# EAGLE design homecomputer-6502 (EAGLE 6.5.0)
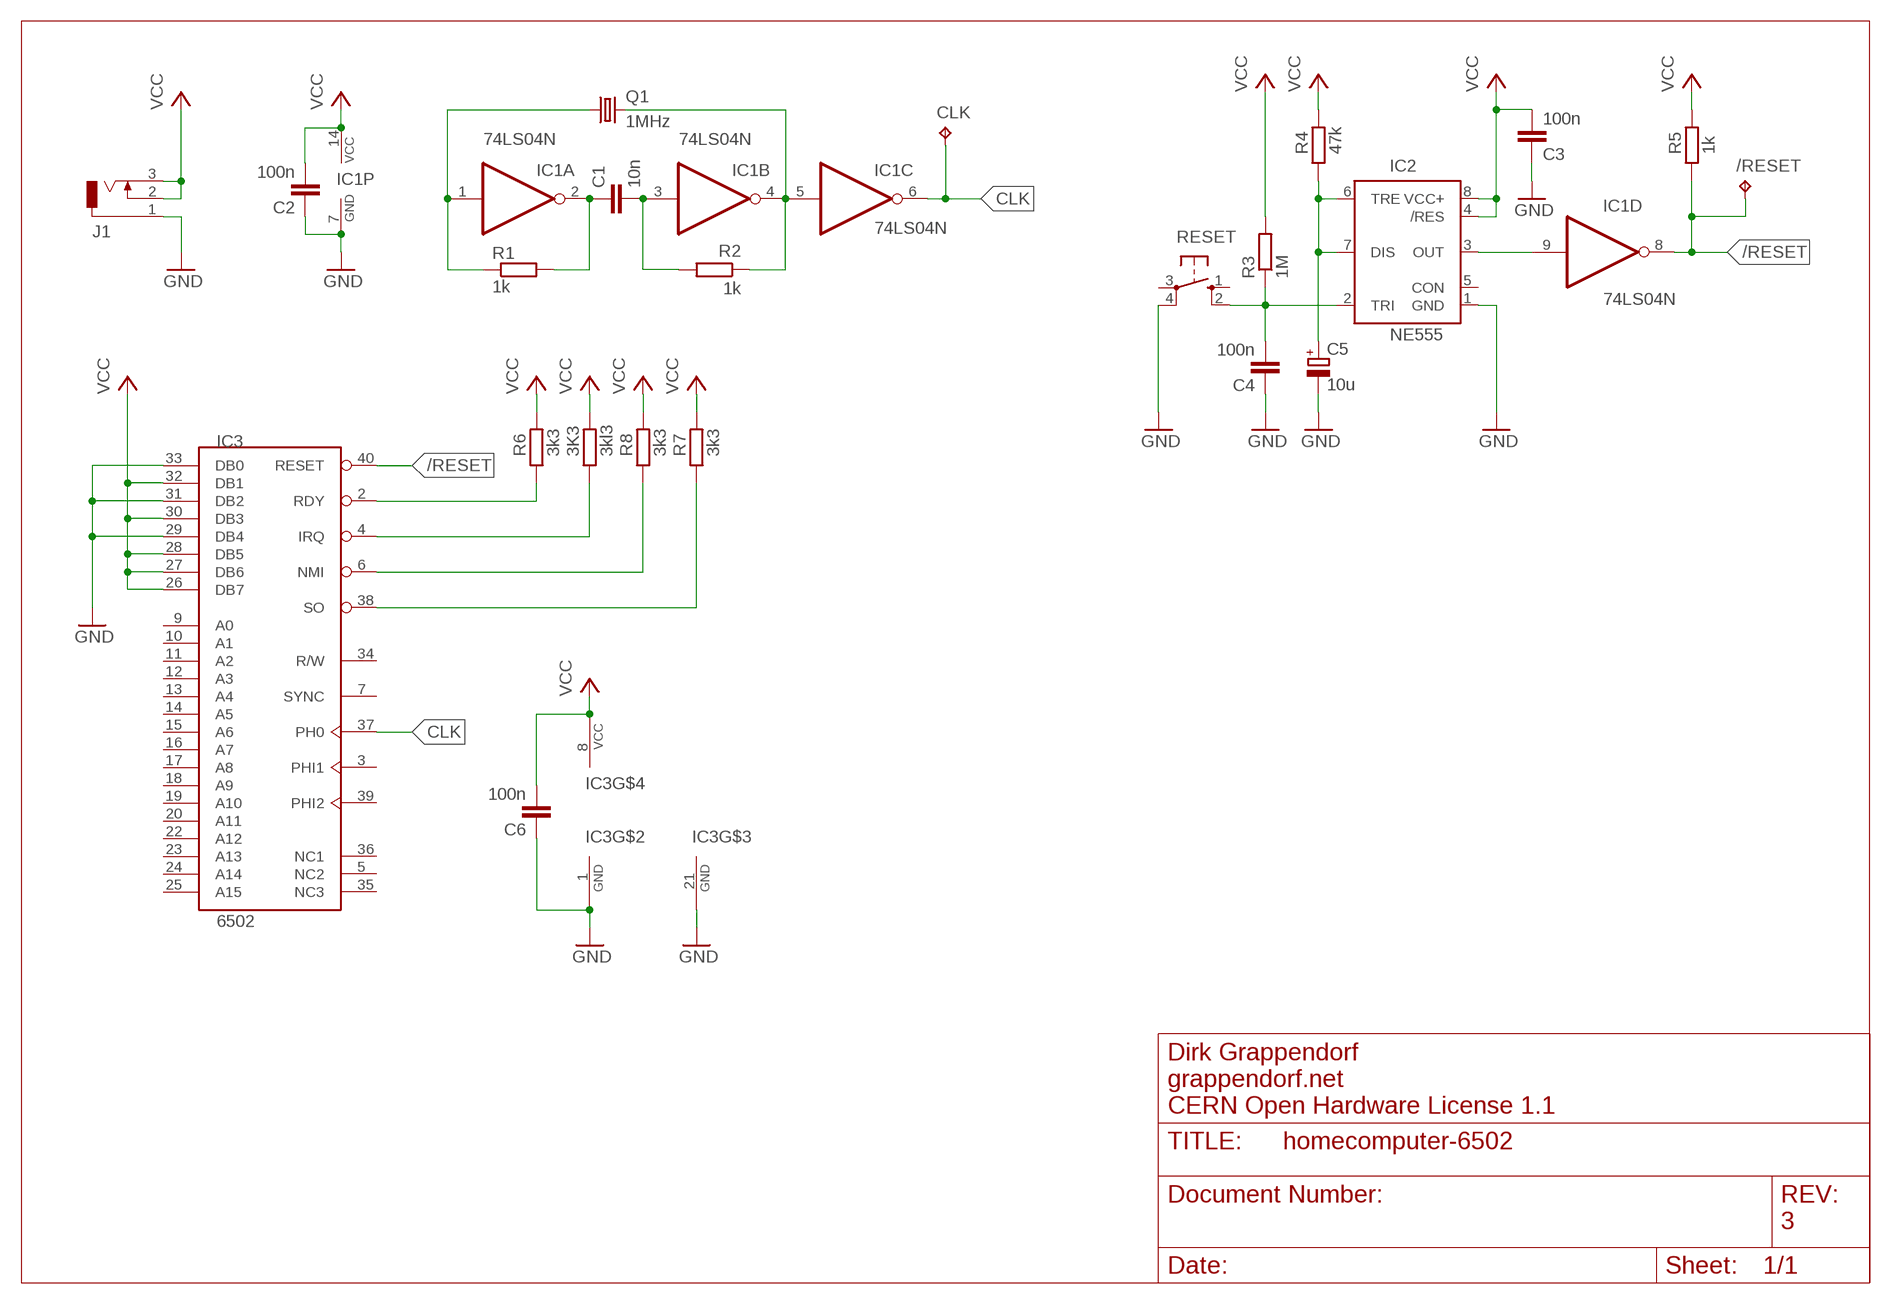
[diagram p0: schematic, sheet 1]

## Parts
3K3  3kl3  R-EU_0204/5  [0204/5]
/RESET  TPPAD1-13  [P1-13]
C1  10n  C-EU025-024X044  [C025-024X044]
C2  100n  C-EU025-024X044  [C025-024X044]
C3  100n  C-EU025-024X044  [C025-024X044]
C4  100n  C-EU025-024X044  [C025-024X044]
C5  10u  CPOL-EUE2,5-6E  [E2,5-6E]
C6  100n  C-EU025-024X044  [C025-024X044]
CLK  TPPAD1-13  [P1-13]
IC1  74LS04N  [DIL14]
IC2  NE555  [DIL-08]
IC3  6502  [DIP40]
J1  DCJ0303  [DCJ0303]
Q1  1MHz  CRYSTALHC49U-V  [HC49U-V]
R1  1k  R-EU_0204/5  [0204/5]
R2  1k  R-EU_0204/5  [0204/5]
R3  1M  R-EU_0204/5  [0204/5]
R4  47k  R-EU_0204/5  [0204/5]
R5  1k  R-EU_0204/5  [0204/5]
R6  3k3  R-EU_0204/5  [0204/5]
R7  3k3  R-EU_0204/5  [0204/5]
R8  3k3  R-EU_0204/5  [0204/5]
RESET  10-XX  [B3F-10XX]

## Nets
/RESET: /RESET.TP IC1.8(D:O) IC3.40(RESET) R5.1
CLK: CLK.TP IC1.6(C:O) IC3.37(PH0)
GND: C2.1 C3.1 C4.1 C5.- C6.1 IC1.7(P:GND) IC2.1(GND) IC3.1(GND) IC3.21(GND) IC3.29(DB4) IC3.31(DB2) IC3.33(DB0) J1.1 RESET.4(P1)
N$1: IC1.1(A:I) Q1.1 R1.1
N$2: C1.1 IC1.2(A:O) R1.2
N$3: IC3.2(RDY) R6.1
N$4: C5.+ IC2.6(TRE) IC2.7(DIS) R4.1
N$5: IC1.9(D:I) IC2.3(OUT)
N$6: C4.2 IC2.2(TRI) R3.1 RESET.2(S1)
N$7: C1.2 IC1.3(B:I) R2.2
N$8: IC1.4(B:O) IC1.5(C:I) Q1.2 R2.1
N$9: 3K3.1 IC3.4(IRQ)
N$10: IC3.6(NMI) R8.1
N$11: IC3.38(SO) R7.1
VCC: 3K3.2 C2.2 C3.2 C6.2 IC1.14(P:VCC) IC2.4(/RES) IC2.8(VCC+) IC3.8(VCC) IC3.26(DB7) IC3.27(DB6) IC3.28(DB5) IC3.30(DB3) IC3.32(DB1) J1.2 J1.3 R3.2 R4.2 R5.2 R6.2 R7.2 R8.2
Unconnected: IC1.10(E:O) IC1.11(E:I) IC1.12(F:O) IC1.13(F:I) IC2.5(CON) IC3.3(PHI1) IC3.5(NC2) IC3.7(SYNC) IC3.9(A0) IC3.10(A1) IC3.11(A2) IC3.12(A3) IC3.13(A4) IC3.14(A5) IC3.15(A6) IC3.16(A7) IC3.17(A8) IC3.18(A9) IC3.19(A10) IC3.20(A11) IC3.22(A12) IC3.23(A13) IC3.24(A14) IC3.25(A15) IC3.34(R/W) IC3.35(NC3) IC3.36(NC1) IC3.39(PHI2) RESET.1(S) RESET.3(P)

## Notes on the sheet
- Dirk Grappendorf
- grappendorf.net
- CERN Open Hardware License 1.1
- 3

## Library data of the parts
3K3 R1-R8 = rcl:R-EU_: RESISTOR, European symbol
/RESET CLK = testpad:TP: Test pad
C1-C4 C6 = rcl:C-EU: CAPACITOR, European symbol
C5 = rcl:CPOL-EU: POLARIZED CAPACITOR, European symbol
IC1 = 74xx-eu:74*04: Hex INVERTER
IC2 = st-microelectronics:NE555: General purpose bipolar Timer; MF: Arrow Electronics; MPN: NE555N; OC_FARNELL: 1467742; OC_NEWARK: 89K1486
IC3 = 6502:6502: 6502 processor
J1 = con-jack:DCJ0303: DC POWER JACK Source: DCJ0303.pdf; OC_FARNELL: unknown; OC_NEWARK: unknown
Q1 = crystal:CRYSTAL: CRYSTAL; OC_FARNELL: 1666969; OC_NEWARK: unknown
RESET = switch-omron:10-XX: OMRON SWITCH; MPN: B3F-1000; OC_FARNELL: 176432; OC_NEWARK: 36M3542

## Board
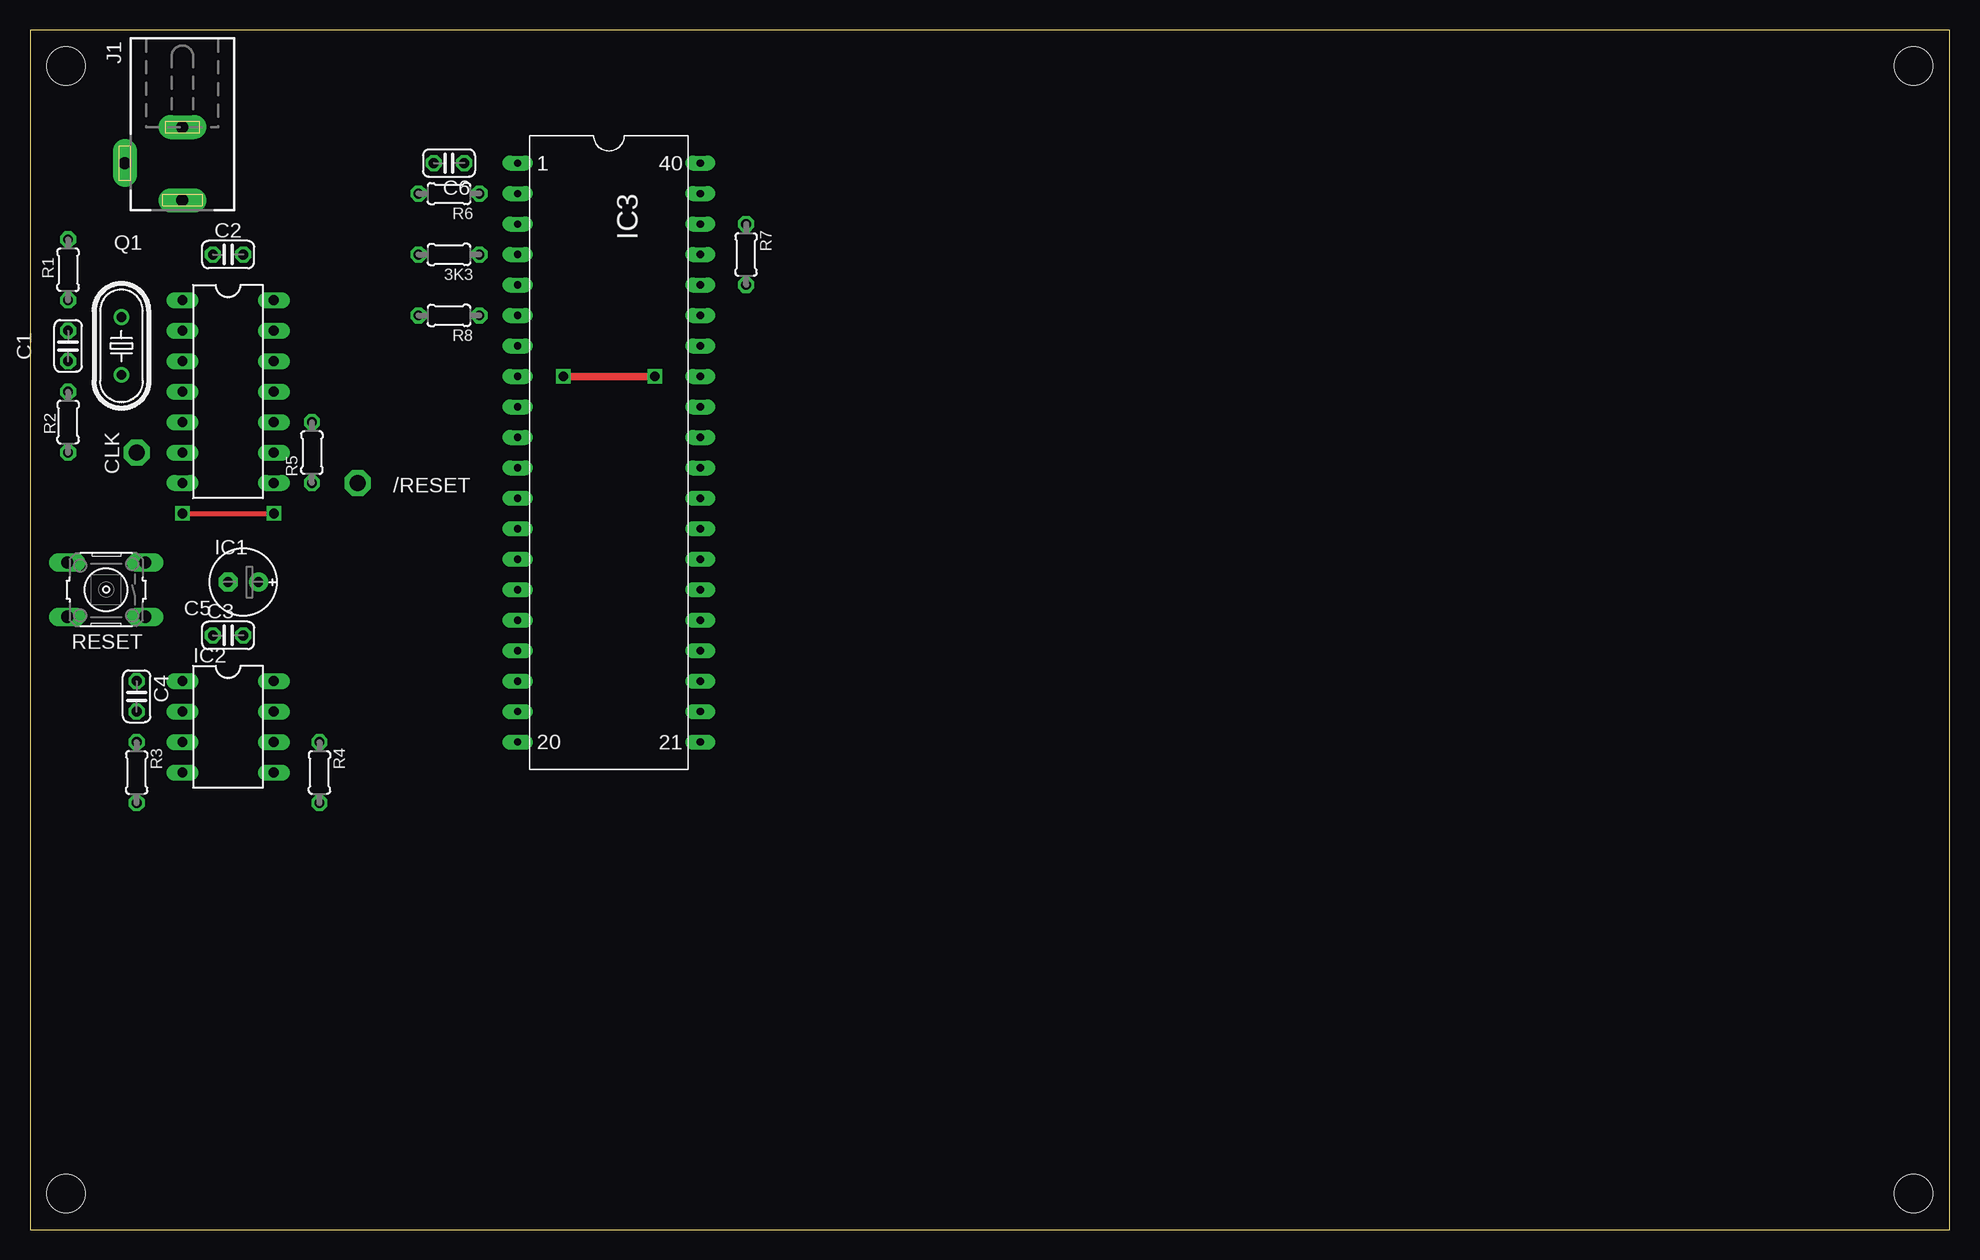
[diagram p1: board, top side]
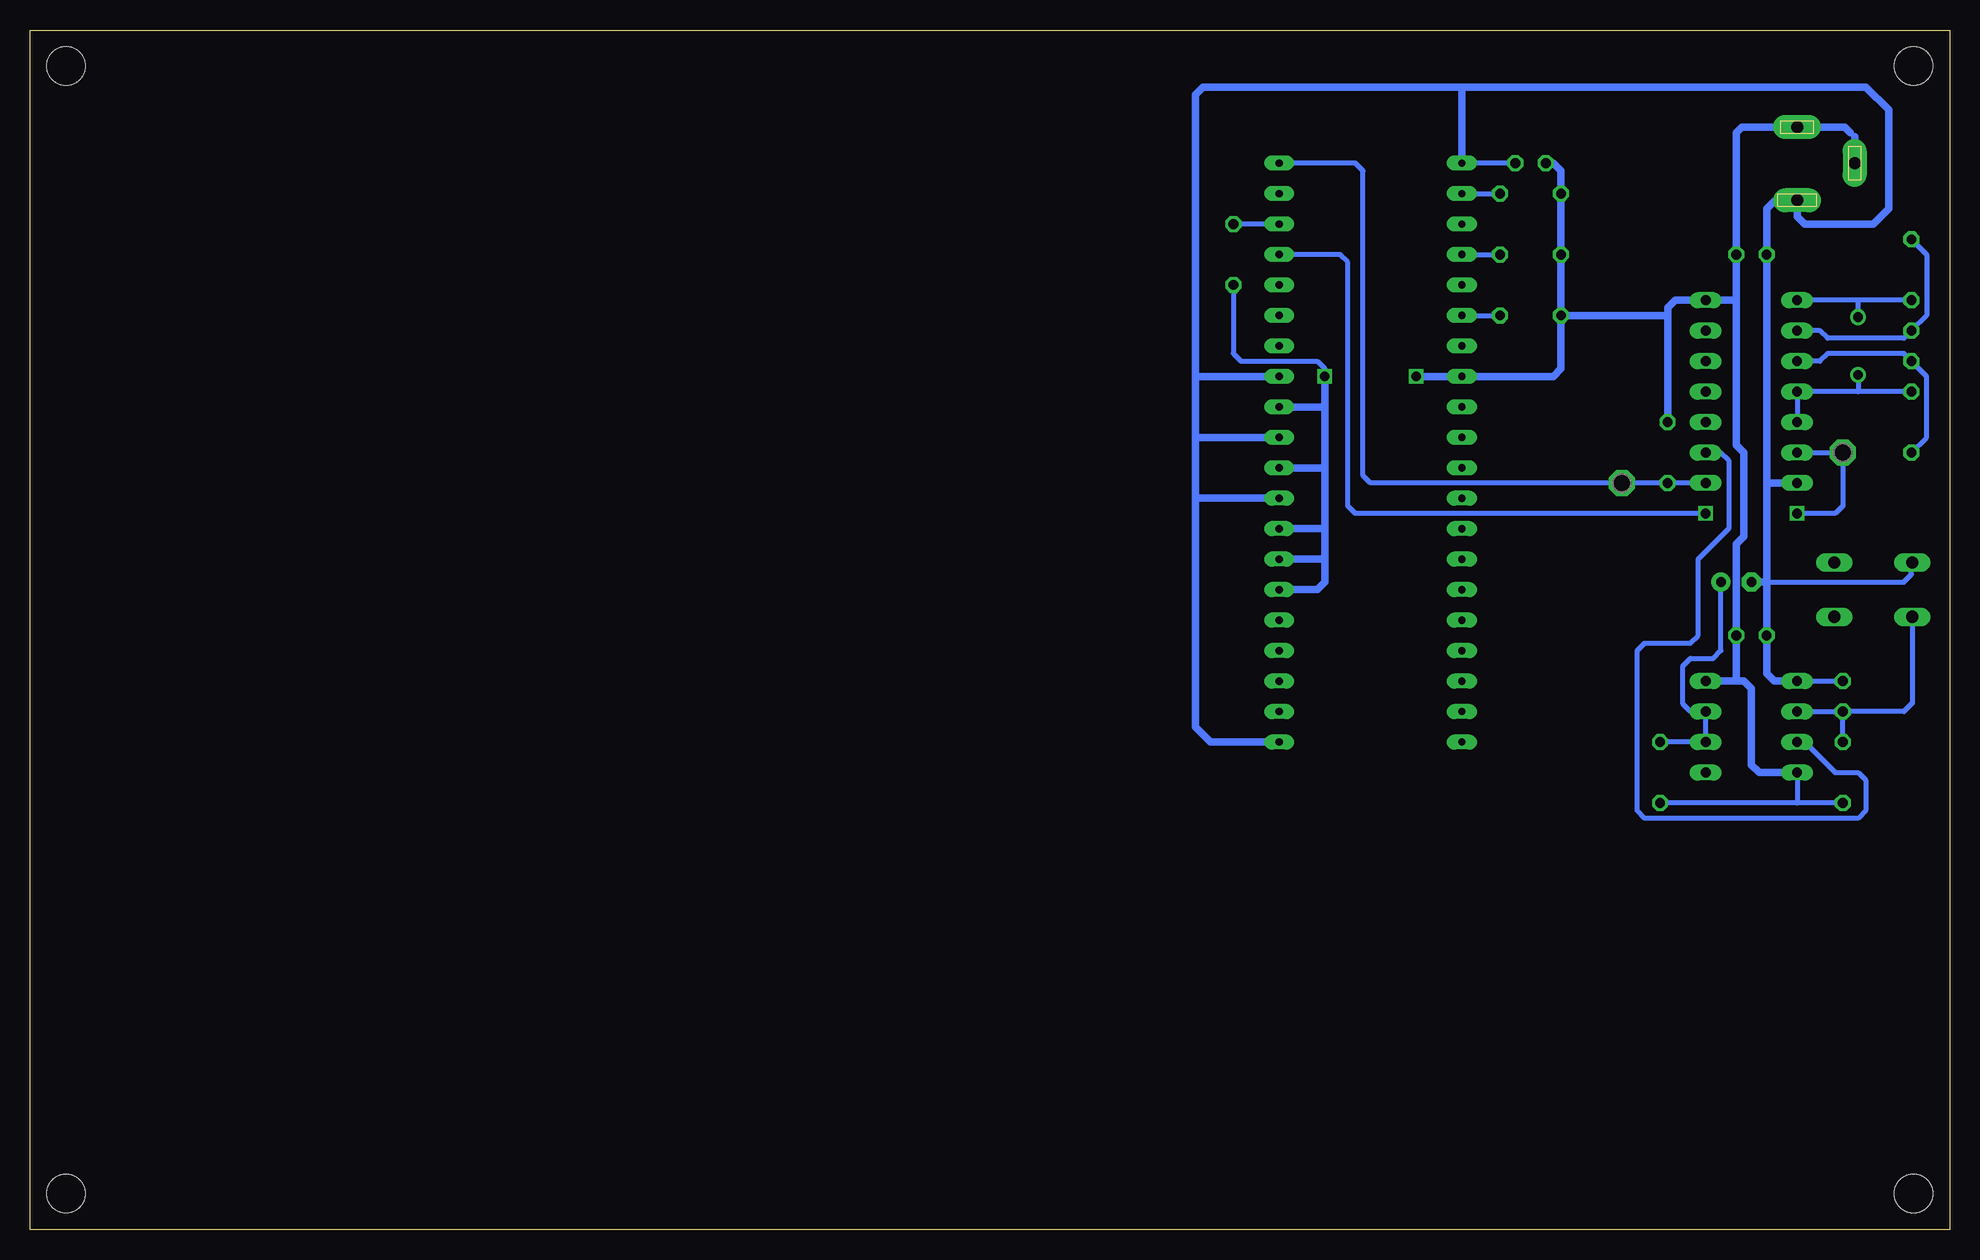
[diagram p2: board, bottom side, seen from below]

Size 160 x 100 mm. Coordinates in mm from the lower left corner, seen from the top.
Outline: 0,0 160,0 160,100 0,100 0,0
Copper layers (1*16): Top 0.035mm / dielectric 1.5mm / Bottom 0.035mm
Design rules "default": minimum track width 10mil, minimum drill 24mil, track to track 8mil, track to pad 8mil, pad to pad 8mil, via to via 8mil, smd to smd 8mil, copper to edge 40mil, drill to drill 8mil, minimum pad ring 10mil, minimum via ring 8mil, stop-mask expansion 4mil, vias tented up to drill 0mil, thermal gap 10mil
Holes 3.2 mm at 3,97 157,97 3,3 157,3

### Footprints (pad centres in the part's own frame; a part is rotated, then mirrored left to right if it is on the bottom)
0204/5 = drill 0.813 octagon: 1 -2.54,0; 2 2.54,0
P1-13 = drill 1.321 pad 2.159 octagon: TP 0,0
C025-024X044 = drill 0.813 octagon: 1 -1.27,0; 2 1.27,0
E2,5-6E = drill 0.813 pad 1.575: + -1.27,0 | drill 0.813 pad 1.575 octagon: - 1.27,0
DIL14 = drill 0.813 long: 1 -7.62,-3.81; 2 -5.08,-3.81; 3 -2.54,-3.81; 4 0,-3.81; 5 2.54,-3.81; 6 5.08,-3.81; 7 7.62,-3.81; 8 7.62,3.81; 9 5.08,3.81; 10 2.54,3.81; 11 0,3.81; 12 -2.54,3.81; 13 -5.08,3.81; 14 -7.62,3.81
DIL-08 = drill 0.813 long: 1 -3.81,-3.81; 2 -1.27,-3.81; 3 1.27,-3.81; 4 3.81,-3.81; 5 3.81,3.81; 6 1.27,3.81; 7 -1.27,3.81; 8 -3.81,3.81
DIP40 = drill 0.61 pad 1.27 long: 1 -24.13,-7.62; 2 -21.59,-7.62; 3 -19.05,-7.62; 4 -16.51,-7.62; 5 -13.97,-7.62; 6 -11.43,-7.62; 7 -8.89,-7.62; 8 -6.35,-7.62; 9 -3.81,-7.62; 10 -1.27,-7.62; 11 1.27,-7.62; 12 3.81,-7.62; 13 6.35,-7.62; 14 8.89,-7.62; 15 11.43,-7.62; 16 13.97,-7.62; 17 16.51,-7.62; 18 19.05,-7.62; 19 21.59,-7.62; 20 24.13,-7.62; 21 24.13,7.62; 22 21.59,7.62; 23 19.05,7.62; 24 16.51,7.62; 25 13.97,7.62; 26 11.43,7.62; 27 8.89,7.62; 28 6.35,7.62; 29 3.81,7.62; 30 1.27,7.62; 31 -1.27,7.62; 32 -3.81,7.62; 33 -6.35,7.62; 34 -8.89,7.62; 35 -11.43,7.62; 36 -13.97,7.62; 37 -16.51,7.62; 38 -19.05,7.62; 39 -21.59,7.62; 40 -24.13,7.62
DCJ0303 = drill 1 pad 2 long: 1 0,3.1; 2 4.8,0; 3 0,-3
HC49U-V = drill 0.813: 1 -2.413,0; 2 2.413,0
B3F-10XX = drill 1.016 long: 1 -3.251,2.261; 2 3.251,2.261; 3 -3.251,-2.261; 4 3.251,-2.261

### Placement (x,y rotation side)
3K3  34.92,81.28 180 top
/RESET  27.3,62.23 180 bottom
C1  3.17,73.66 270 top
C2  16.51,81.28 0 top
C3  16.51,49.53 0 top
C4  8.89,44.45 270 top
C5  17.78,53.98 180 top
C6  34.92,88.9 180 top
CLK  8.89,64.77 0 bottom
IC1  16.51,69.85 270 top
IC2  16.51,41.91 270 top
IC3  48.26,64.77 270 top
J1  12.7,88.9 180 top
Q1  7.62,73.66 270 top
R1  3.17,80.01 90 top
R2  3.17,67.31 270 top
R3  8.89,38.1 270 top
R4  24.13,38.1 270 top
R5  23.5,64.77 90 top
R6  34.92,86.36 180 top
R7  59.69,81.28 270 top
R8  34.92,76.2 180 top
RESET  6.35,53.34 180 top

### Tracks (layer width: path | path; a pad name or v marks a point on that pad's centre or on a via)
/RESET
  Bottom 0.406: IC1.8 R5.1 /RESET.TP 48.26,62.23 48.9,62.87 48.9,88.27 49.53,88.9 IC3.40
CLK  (via drill 0.8)
  Top 0.406: v12.7,59.69 v20.32,59.69
  Bottom 0.406: IC1.6 CLK.TP 8.89,60.33 9.53,59.69 v12.7,59.69 | v20.32,59.69 49.53,59.69 50.16,60.33 50.16,80.64 50.8,81.28 IC3.37
GND
  Bottom 0.406: IC2.1 C4.1 | 12.78,85.72 J1.1 | C6.1 IC3.1 | 15.24,53.98 3.81,53.98 3.17,54.61 3.17,55.52 RESET.4
  Bottom 0.61: IC2.1 14.61,45.72 15.24,46.35 C3.1 15.24,53.98 | 15.24,53.98 15.24,62.23 | 15.24,62.23 C2.1 15.24,85.09 14.61,85.72 12.78,85.72 | IC1.7 15.24,62.23 | C5.- 15.24,53.98 | J1.1 12.7,84.45 12.06,83.82 6.35,83.82 5.08,85.09 5.08,93.34 6.99,95.25 40.64,95.25 | 40.64,95.25 62.23,95.25 62.87,94.61 62.87,71.12 | IC3.1 40.64,95.25 | 62.87,71.12 62.87,66.04 | 62.87,66.04 62.87,60.96 | 62.87,60.96 62.87,41.91 61.59,40.64 IC3.21 | IC3.29 62.87,60.96 | IC3.31 62.87,66.04 | IC3.33 62.87,71.12
N$1
  Bottom 0.406: R1.1 7.62,77.47 | 7.62,77.47 IC1.1 | Q1.1 7.62,77.47
N$2
  Bottom 0.406: IC1.2 10.79,74.93 10.16,74.3 3.81,74.3 C1.1 1.91,76.2 1.91,81.28 R1.2
N$3
  Bottom 0.406: IC3.2 R6.1
N$4
  Bottom 0.406: R4.1 IC2.6 IC2.7 21.59,43.18 22.23,43.81 22.23,46.99 21.59,47.62 19.68,47.62 19.05,48.26 C5.+
N$5
  Bottom 0.406: IC2.3 12.06,40.64 9.53,38.1 7.62,38.1 6.99,37.47 6.99,34.92 7.62,34.29 25.4,34.29 26.04,34.92 26.04,48.26 25.4,48.9 21.59,48.9 20.95,49.53 20.95,55.88 19.05,57.78 18.41,58.42 18.41,64.14 19.05,64.77 IC1.9
N$6
  Bottom 0.406: IC2.2 C4.2 | R3.1 C4.2 | RESET.2 3.1,43.89 3.81,43.18 C4.2
N$7
  Bottom 0.406: IC1.3 10.79,72.39 10.16,73.03 3.81,73.03 C1.2 1.91,71.12 1.91,66.04 R2.2
N$8
  Bottom 0.406: IC1.5 IC1.4 7.62,69.85 | R2.1 7.62,69.85 | Q1.2 7.62,69.85
N$9
  Bottom 0.406: IC3.4 3K3.1
N$10
  Bottom 0.406: IC3.6 R8.1
N$11
  Bottom 0.406: IC3.38 R7.1
VCC  (via drill 0.8)
  Top 0.61: v44.45,71.12 v52.07,71.12
  Bottom 0.406: 7.9,91.08 8.26,91.44 | R3.2 12.7,35.56 | 12.7,35.56 R4.2 | IC2.4 12.7,35.56 | R7.2 59.69,73.03 59.05,72.39 52.7,72.39 52.07,71.75 v52.07,71.12
  Bottom 0.61: J1.2 7.9,91.08 | 8.26,91.44 8.71,91.9 J1.3 17.32,91.9 17.78,91.44 C2.2 17.78,77.47 | IC2.4 15.88,38.1 16.51,38.73 16.51,45.09 17.14,45.72 17.78,45.72 | 17.78,45.72 IC2.8 | 17.78,45.72 C3.2 17.78,57.15 17.14,57.78 17.14,64.77 17.78,65.41 17.78,77.47 | R5.2 23.5,76.2 | 23.5,76.2 23.5,76.83 22.86,77.47 IC1.14 17.78,77.47 | R8.2 3K3.2 R6.2 32.38,88.27 33.02,88.9 C6.2 | R8.2 23.5,76.2 | R8.2 32.38,71.75 33.02,71.12 IC3.8 v44.45,71.12 | 52.07,63.5 52.07,58.42 | 52.07,58.42 52.07,55.88 | 52.07,55.88 52.07,53.98 52.7,53.34 IC3.26 | IC3.30 52.07,63.5 | IC3.27 52.07,55.88 | IC3.28 52.07,58.42 | v52.07,71.12 52.07,68.58 | 52.07,68.58 52.07,63.5 | IC3.32 52.07,68.58